# Altium project ESP_audio_switch.PrjPCB
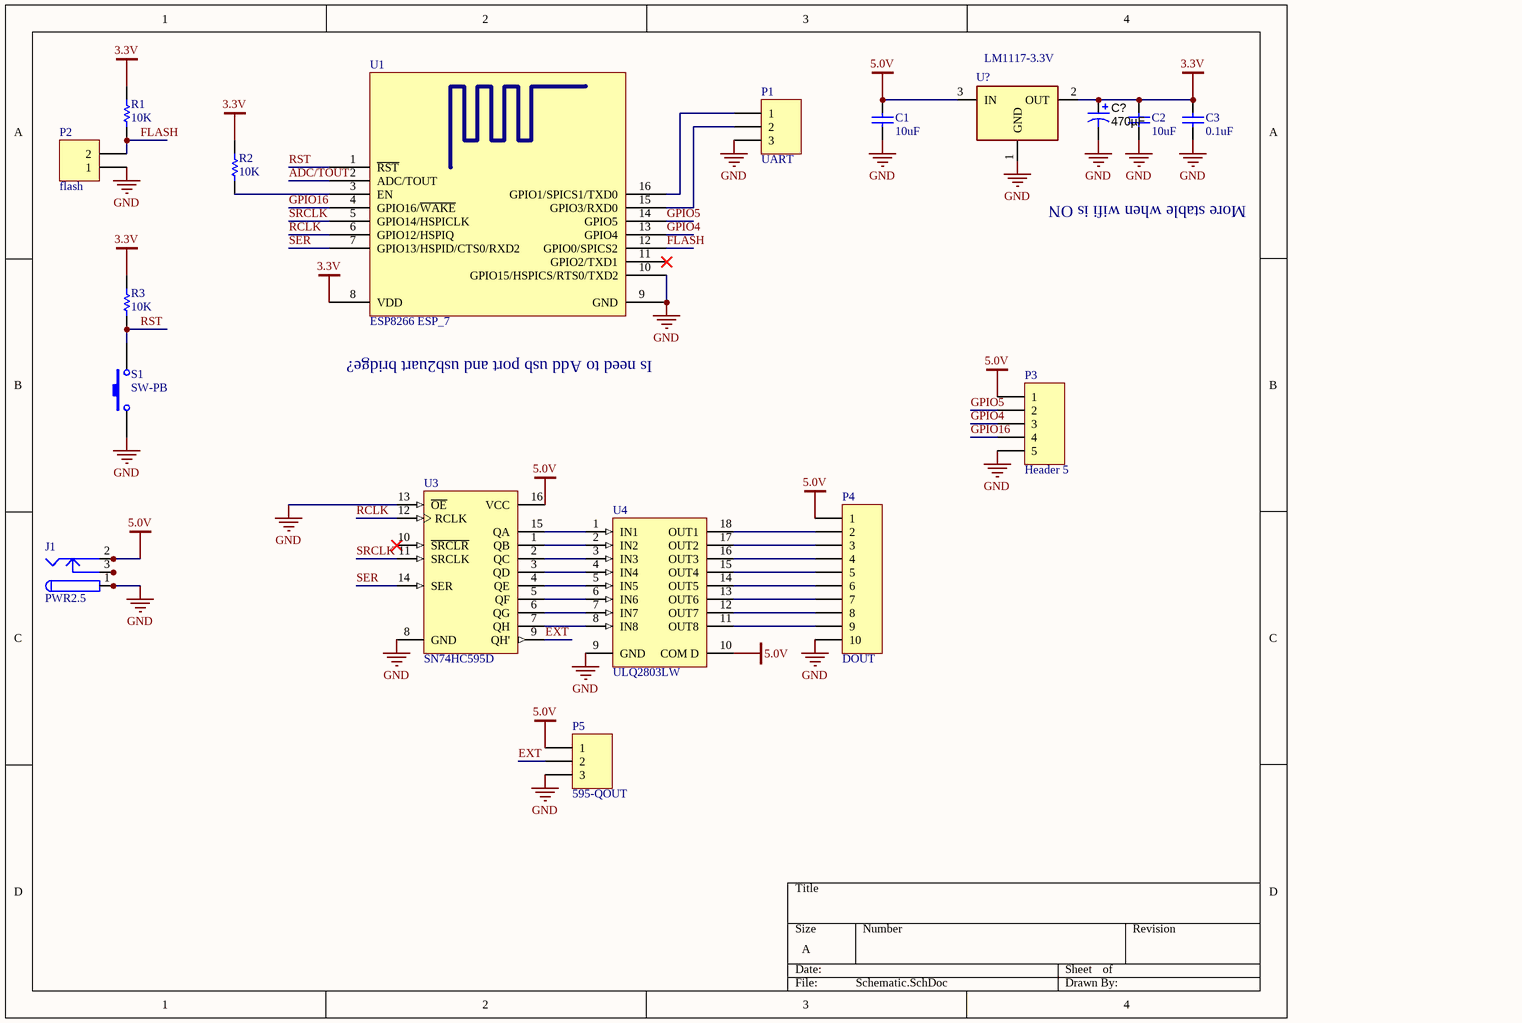
[diagram p0: Schematic.SchDoc]
1 sheet, 18 parts. Net scope: global (net labels, ports and power ports of the same name join across sheets).

## Sheet Schematic.SchDoc
size A

### Parts
C1  value 10uF  [C1206]  (hidden comment: Cap Semi)
C2  value 10uF  [C1206]  (hidden comment: Cap Semi)
C3  value 0.1uF  [C1206]  (hidden comment: Cap Semi)
C?  ValueDisplayed: 470µF  [7260-38]  (hidden comment: T495E477K010ATE040)
J1  PWR2.5  [Jack-DC]
P1  UART  [HDR1X3]
P2  flash  [HDR1X2]
P3  Header 5  [HDR1X5]
P4  DOUT  [HDR1X10]
P5  595-QOUT  [HDR1X3]
R1  value 10K  [6-0805_N]  (hidden comment: Res1)
R2  value 10K  [6-0805_N]  (hidden comment: Res1)
R3  value 10K  [6-0805_N]  (hidden comment: Res1)
S1  SW-PB  [SW-SMD]
U1  ESP8266 ESP_7  [ESP8266 ESP_12]
U3  SN74HC595D  [SOP16]
U4  ULQ2803LW  [soic18_m]
U?  LM1117-3.3V  [SOT223-4N]

### Nets
3.3V: C2.2 C3.2 C?.1(+) R1.2 R2.2 R3.2 U1.8(VDD) U?.2(OUT)
5.0V: C1.2 J1.2 J1.2A J1.2B P3.1 P4.1 P5.1 U3.16(VCC) U4.10(COM_D) U?.3(IN)
GND: C1.1 C2.1 C3.1 C?.2(-) J1.1 J1.1A J1.1B P1.3 P2.1 P3.5 P4.10 P5.3 S1.1 U1.9(GND) U1.10(GPIO15/HSPICS/RTS0/TXD2) U3.8(GND) U3.13(~{OE}) U4.9(GND) U?.1(GND)
ADC/TOUT: U1.2(ADC/TOUT)
EXT: P5.2 U3.9(QH')
FLASH: P2.2 R1.1 U1.12(GPIO0/SPICS2)
GPIO4: P3.3 U1.13(GPIO4)
GPIO5: P3.2 U1.14(GPIO5)
GPIO16: P3.4 U1.4(GPIO16/~{WAKE})
RCLK: U1.6(GPIO12/HSPIQ) U3.12(RCLK)
RST: R3.1 S1.2 U1.1(~{RST})
SER: U1.7(GPIO13/HSPID/CTS0/RXD2) U3.14(SER)
SRCLK: U1.5(GPIO14/HSPICLK) U3.11(SRCLK)
NetJ1_3: J1.3 J1.3A J1.3B
NetP1_1: P1.1 U1.16(GPIO1/SPICS1/TXD0)
NetP1_2: P1.2 U1.15(GPIO3/RXD0)
NetP4_2: P4.2 U4.18(OUT1)
NetP4_3: P4.3 U4.17(OUT2)
NetP4_4: P4.4 U4.16(OUT3)
NetP4_5: P4.5 U4.15(OUT4)
NetP4_6: P4.6 U4.14(OUT5)
NetP4_7: P4.7 U4.13(OUT6)
NetP4_8: P4.8 U4.12(OUT7)
NetP4_9: P4.9 U4.11(OUT8)
NetR2_1: R2.1 U1.3(EN)
NetU3_1: U3.1(QB) U4.2(IN2)
NetU3_2: U3.2(QC) U4.3(IN3)
NetU3_3: U3.3(QD) U4.4(IN4)
NetU3_4: U3.4(QE) U4.5(IN5)
NetU3_5: U3.5(QF) U4.6(IN6)
NetU3_6: U3.6(QG) U4.7(IN7)
NetU3_7: U3.7(QH) U4.8(IN8)
NetU3_15: U3.15(QA) U4.1(IN1)

Not connected (* = marked no-connect by the designer): U1 11(GPIO2/TXD1)*; U3 10(~{SRCLR})*

### Notes on the sheet
- More stable when wifi is ON
- Is need to Add usb port and usb2uart bridge?

### Library data of the parts
C1-C3 = Cap Semi: Capacitor (Semiconductor SIM Model); Published: 8-Jun-2000; LatestRevisionDate: 29-May-2009; LatestRevisionNote: IPC-7351 Footprint Added.; PackageReference: C1206; Publisher: Altium Limited; PackageDescription: Chip Capacitor
C? = T495E477K010ATE040: CAP, TANT, 470uF, 10V, +/-10%, 0.04 ohm, 7260-38 SMD; Manufacturer: Kemet; Polarized: Y; CompType: Capacitor; U/M: EA; Cap_F: 0.00047; Tolerance_%: 10; ESR_Ohm: 0.04; IRMS_A: 2.012; TaMin_C: -55; TaMax_C: 125; Cap_Case: E; SymbolVersion: 2008-07-09; Value: 470uF; PartNumber: T495E477K010ATE040; PackageReference: 7260-38; RoHS: Y; Value1: 0.04 ohm; VDC_V: 10; Value2: 10V; MountType: SMT; Technology: TA; Series: T495; Published: 2008-06-19; Publisher: Texas Instruments; LatestRevisionDate: 2012-08-28; LatestRevisionNote: Changed Publisher; ComponentLink1Description: Datasheet link; ComponentLink1URL: http://www.kemet.com/kemet/web/homepage/kechome.nsf/file/T495%20Series/$file/F3102_T495.pdf; Alternate PartNumber: -; Alternate Manufacturer: -; Supplier 1: Digi-Key; Supplier Part Number 1: 399-5127-1-ND; Supplier 2: Arrow; Supplier Part Number 2: T495E477K010ATE040
J1 = PWR2.5: Low Voltage Power Supply Connector; Published: 17-Dec-2003; DatasheetDocument: 09-May-2002; Publisher: Altium Limited; ComponentLink1Description: Manufacturer Link; ComponentLink1URL: http://domino.kycon.com/internet/Products.html
P1 P5 = Header 3: Header, 3-Pin; LatestRevisionDate: 17-Jul-2002; LatestRevisionNote: Re-released for DXP Platform.; Publisher: Altium Limited
P2 = Header 2: Header, 2-Pin; LatestRevisionDate: 17-Jul-2002; LatestRevisionNote: Re-released for DXP Platform.; Publisher: Altium Limited
P3 = Header 5: Header, 5-Pin; LatestRevisionDate: 17-Jul-2002; LatestRevisionNote: Re-released for DXP Platform.; Publisher: Altium Limited
P4 = Header 10: Header, 10-Pin; LatestRevisionDate: 17-Jul-2002; LatestRevisionNote: Re-released for DXP Platform.; Publisher: Altium Limited
R1-R3 = Res1: Resistor; Published: 8-Jun-2000; LatestRevisionDate: 17-Jul-2002; LatestRevisionNote: Re-released for DXP Platform.; PackageReference: AXIAL-0.3; Publisher: Altium Limited; PackageDescription: Axial Device, Thru-Hole; 2 Leads; 0.3 in Pin Spacing
S1 = SW-PB: Switch; Published: 24-Mar-1999; LatestRevisionDate: 17-Jul-2002; LatestRevisionNote: Re-released for DXP Platform.; PackageReference: SPST-2; Publisher: Altium Limited; PackageDescription: Switch; 2 Leads
U1 = ESP8266 ESP_12: ESP8266 ESP-12; IC: ESP8266-EX; Vendor: Ai-thinker; LatestReviewer: Zion Blue; Published: 14-Apr-2015; Publisher: Cynetik Group; LatestRevisionData: 14-Apr-2015; LatestRevisionNote: Include 3D body and Footprint
U3 = SN74HC595D: 8-Bit Shift Register with 3-State Output Registers; Published: 8-Jun-2000; LatestRevisionDate: 13-Apr-2006; LatestRevisionNote: IPC-7351 Footprint Added.; DatasheetVersion: May-1997; PackageVersion: Jan-1998; PackageReference: D016; Publisher: Altium Limited; PackageDescription: 16-Pin Small Outline Integrated Circuit 1.27 mm Pitch; Code_IPC: SOIC127P600-16; ComponentLink1Description: Manufacturer Link; ComponentLink1URL: http://www.ti.com/; ComponentLink2Description: http://banlinhkien.vn/goods-672-74hc595d-sop16.html; ComponentLink2URL: http://www.nxp.com/documents/data_sheet/74HC_HCT595.pdf
U4 = ULQ2803LW: High-Voltage, High-Current Darlington Array; Published: 13-Oct-2000; LatestRevisionDate: 13-Apr-2006; LatestRevisionNote: IPC-7351 Footprint Added.; DatasheetVersion: 1999; PackageReference: LW18; Publisher: Altium Limited; PackageDescription: 18-Pin Small Outline Integrated Circuit 1.27 mm Pitch; Code_JEDEC: MS-013-AB; ComponentLink1Description: Manufacturer Link; ComponentLink1URL: http://www.allegromicro.com/
U? = LM1117: 800mA Low-Dropout Linear Regulator; Creator: Nguyen Ba Bien; Website: http://group3i.net